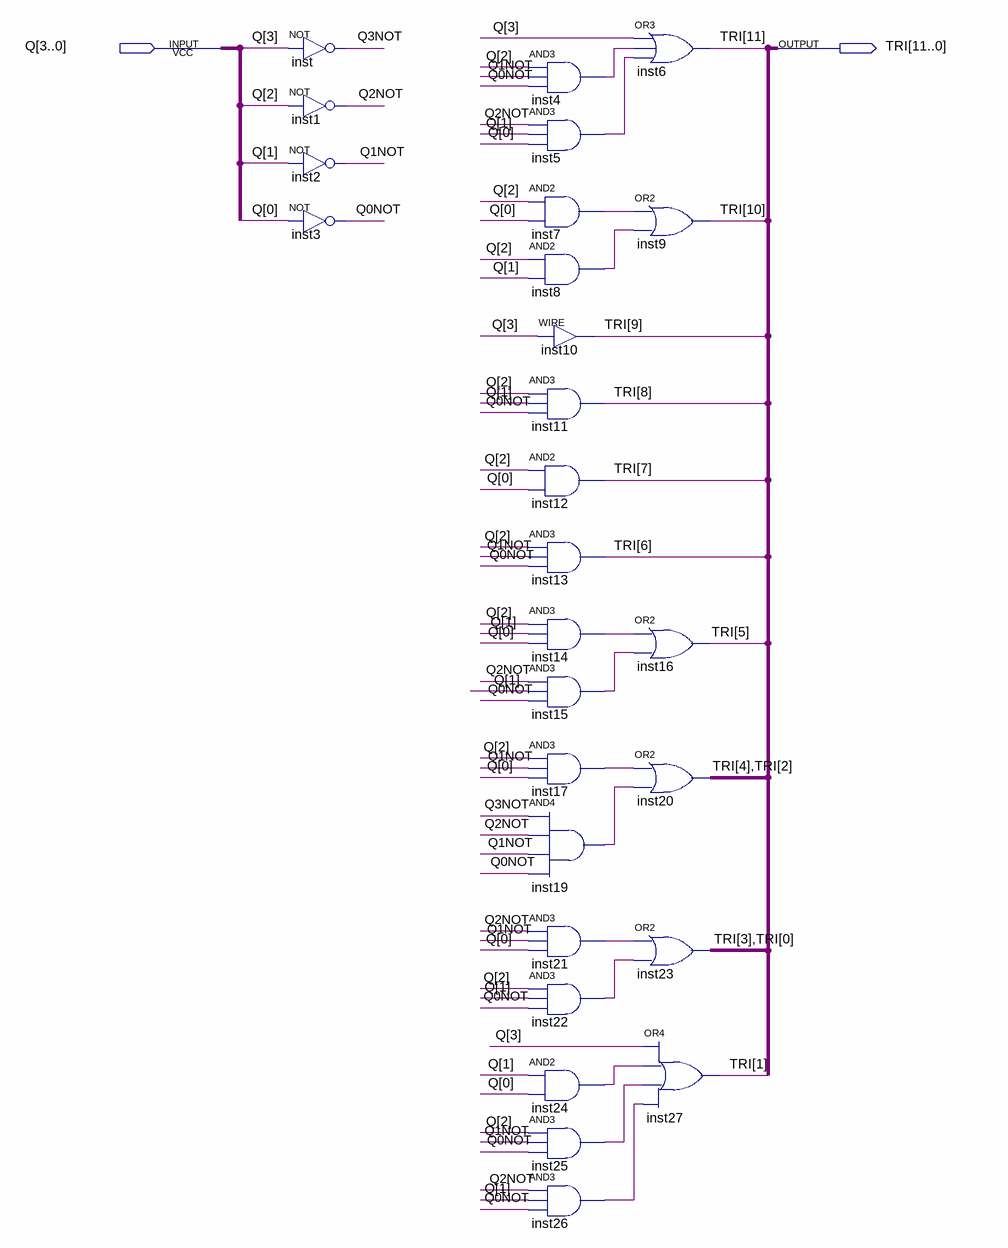
[diagram p0: schematic sheet]
// Quartus schematic DECODE_TRI.bdf as structural Verilog: 27 symbols, 2 pins
module DECODE_TRI (
  input  [3:0] Q,
  output [11:0] TRI
);

  wire inst4_out, inst5_out, inst7_out, inst8_out, inst14_out, inst15_out, inst17_out, inst19_out,
       inst21_out, inst22_out, inst24_out, inst25_out, inst26_out, Q0NOT, Q1NOT, Q2NOT, Q3NOT;

  not inst (Q3NOT, Q[3]);
  not inst1 (Q2NOT, Q[2]);
  not inst2 (Q1NOT, Q[1]);
  not inst3 (Q0NOT, Q[0]);
  and inst4 (inst4_out, Q[2], Q1NOT, Q0NOT);
  and inst5 (inst5_out, Q2NOT, Q[1], Q[0]);
  and inst7 (inst7_out, Q[2], Q[0]);
  and inst8 (inst8_out, Q[2], Q[1]);
  assign TRI[9] = Q[3];  // WIRE inst10
  and inst11 (TRI[8], Q[2], Q[1], Q0NOT);
  and inst12 (TRI[7], Q[2], Q[0]);
  and inst13 (TRI[6], Q[2], Q1NOT, Q0NOT);
  and inst14 (inst14_out, Q[2], Q[1], Q[0]);
  and inst15 (inst15_out, Q2NOT, Q[1], Q0NOT);
  and inst17 (inst17_out, Q[2], Q1NOT, Q[0]);
  and inst19 (inst19_out, Q3NOT, Q2NOT, Q1NOT, Q0NOT);
  and inst21 (inst21_out, Q2NOT, Q1NOT, Q[0]);
  and inst22 (inst22_out, Q[2], Q[1], Q0NOT);
  and inst24 (inst24_out, Q[1], Q[0]);
  and inst25 (inst25_out, Q[2], Q1NOT, Q0NOT);
  and inst26 (inst26_out, Q2NOT, Q[1], Q0NOT);
  or inst6 (TRI[11], Q[3], inst4_out, inst5_out);
  or inst9 (TRI[10], inst7_out, inst8_out);
  or inst16 (TRI[5], inst14_out, inst15_out);
  assign {TRI[4], TRI[2]} = {2{inst17_out}} | {2{inst19_out}};  // OR2 inst20, 2 bits wide
  assign {TRI[3], TRI[0]} = {2{inst21_out}} | {2{inst22_out}};  // OR2 inst23, 2 bits wide
  or inst27 (TRI[1], Q[3], inst24_out, inst25_out, inst26_out);
endmodule
